# Altium schematic sheet DE-260124.SchDoc: RS485 Radio Bridge
size A3; Author: eldar6776@hotmail.com; DrawnBy: Eldar Dedić; Organization: I-MEDIA GROUP d.o.o.; Address1: Topal Osman Paše 18; Address2: 71000 Sarajevo; Address3: Federacija BiH; Address4: Bosna i Hercegovina; DocumentNumber: 1; Revision: 001; SheetNumber: 1; SheetTotal: 1; ProjectName: RS485 Radio Bridge
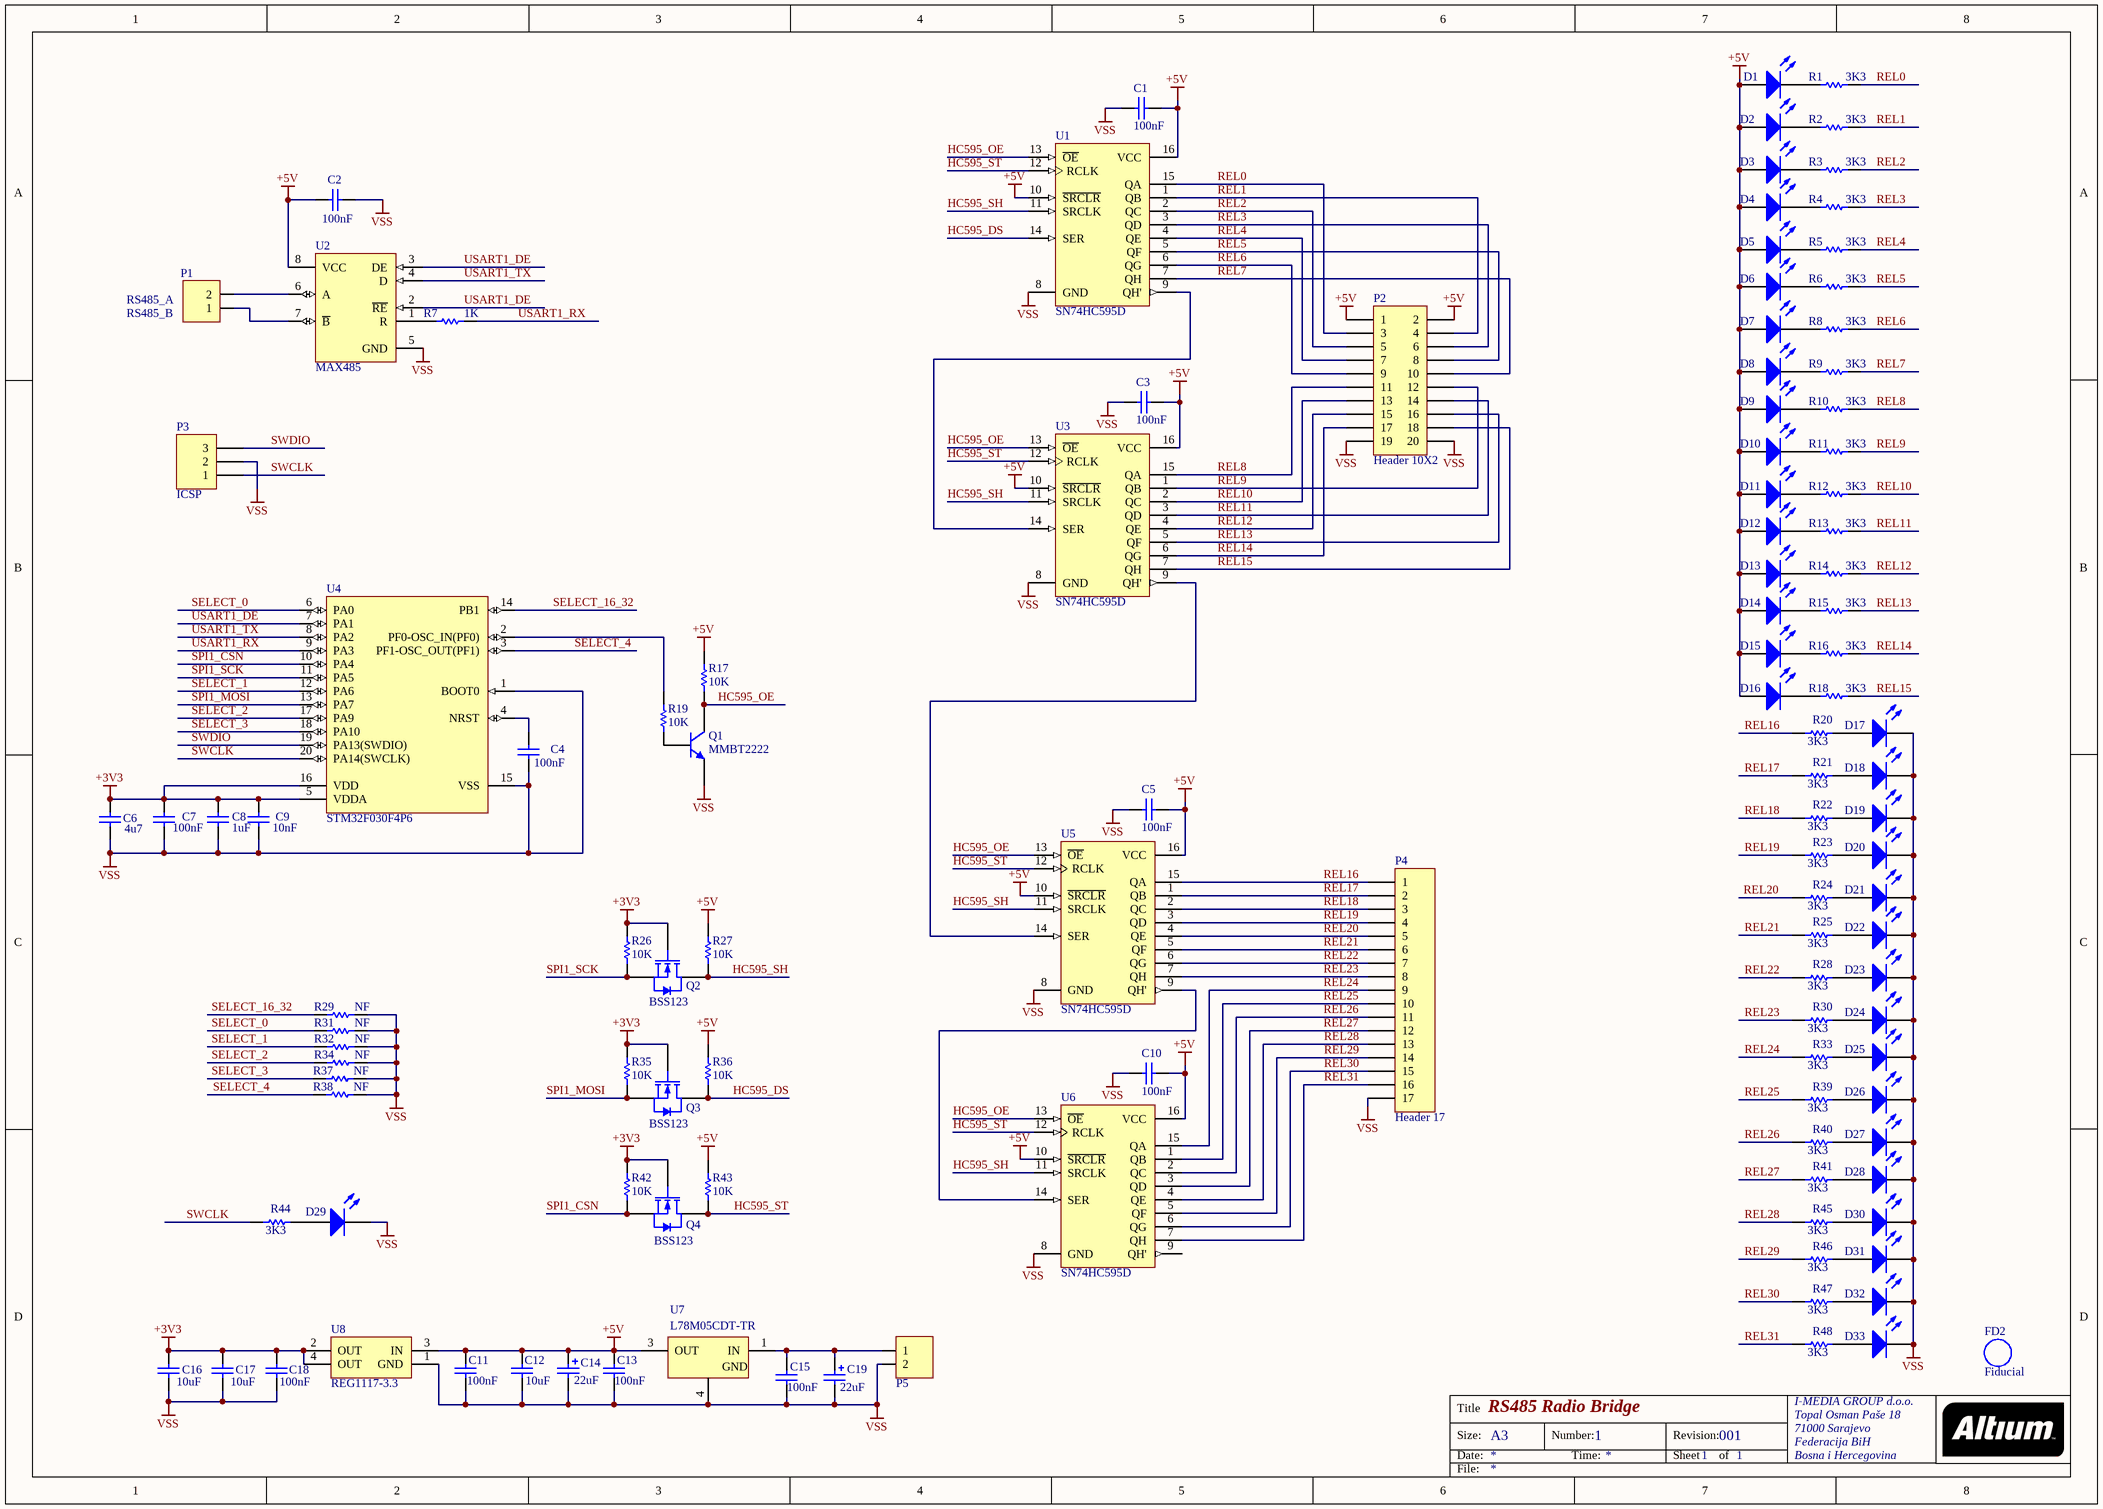
[diagram p0: DE-260124.SchDoc]

## Parts
C1  100nF  [0603]
C2  100nF  [0603]
C3  100nF  [0603]
C4  100nF  [0603]
C5  100nF  [0603]
C6  4u7  [0805]
C7  100nF  [0603]
C8  1uF  [0603]
C9  10nF  [0603]
C10  100nF  [0603]
C11  100nF  [0603]
C12  10uF  [0805]
C13  100nF  [0603]
C14  22uF  [CAPPR2-5X11]
C15  100nF  [0603]
C16  10uF  [0805]
C17  10uF  [0805]
C18  100nF  [0603]
C19  22uF  [CAPPR2-5X11]
D1  LED_RED  [1.6X0.8X0.8]  (value not drawn)
D2  LED_RED  [1.6X0.8X0.8]  (value not drawn)
D3  LED_RED  [1.6X0.8X0.8]  (value not drawn)
D4  LED_RED  [1.6X0.8X0.8]  (value not drawn)
D5  LED_RED  [1.6X0.8X0.8]  (value not drawn)
D6  LED_RED  [1.6X0.8X0.8]  (value not drawn)
D7  LED_RED  [1.6X0.8X0.8]  (value not drawn)
D8  LED_RED  [1.6X0.8X0.8]  (value not drawn)
D9  LED_RED  [1.6X0.8X0.8]  (value not drawn)
D10  LED_RED  [1.6X0.8X0.8]  (value not drawn)
D11  LED_RED  [1.6X0.8X0.8]  (value not drawn)
D12  LED_RED  [1.6X0.8X0.8]  (value not drawn)
D13  LED_RED  [1.6X0.8X0.8]  (value not drawn)
D14  LED_RED  [1.6X0.8X0.8]  (value not drawn)
D15  LED_RED  [1.6X0.8X0.8]  (value not drawn)
D16  LED_RED  [1.6X0.8X0.8]  (value not drawn)
D17  LED_RED  [1.6X0.8X0.8]  (value not drawn)
D18  LED_RED  [1.6X0.8X0.8]  (value not drawn)
D19  LED_RED  [1.6X0.8X0.8]  (value not drawn)
D20  LED_RED  [1.6X0.8X0.8]  (value not drawn)
D21  LED_RED  [1.6X0.8X0.8]  (value not drawn)
D22  LED_RED  [1.6X0.8X0.8]  (value not drawn)
D23  LED_RED  [1.6X0.8X0.8]  (value not drawn)
D24  LED_RED  [1.6X0.8X0.8]  (value not drawn)
D25  LED_RED  [1.6X0.8X0.8]  (value not drawn)
D26  LED_RED  [1.6X0.8X0.8]  (value not drawn)
D27  LED_RED  [1.6X0.8X0.8]  (value not drawn)
D28  LED_RED  [1.6X0.8X0.8]  (value not drawn)
D29  LED_RED  [1.6X0.8X0.8]  (value not drawn)
D30  LED_RED  [1.6X0.8X0.8]  (value not drawn)
D31  LED_RED  [1.6X0.8X0.8]  (value not drawn)
D32  LED_RED  [1.6X0.8X0.8]  (value not drawn)
D33  LED_RED  [1.6X0.8X0.8]  (value not drawn)
FD2  Fiducial  [Fiducial]  (no BOM)
P1  TERMINAL BLOK 2  [TERMINAL BLOK 2]  (value not drawn)
P2  Header 10X2  [HDR2X10]
P3  ICSP  [HDR1X3]
P4  Header 17  [HDR1X17]
P5  TERMINAL BLOK 2  [TERMINAL BLOK 2]  (value not drawn)
Q1  MMBT2222  [SOT23_N]
Q2  BSS123  [SOT23_N]
Q3  BSS123  [SOT23_N]
Q4  BSS123  [SOT23_N]
R1  3K3  [ERA-0603]
R2  3K3  [ERA-0603]
R3  3K3  [ERA-0603]
R4  3K3  [ERA-0603]
R5  3K3  [ERA-0603]
R6  3K3  [ERA-0603]
R7  1K  [ERA-0603]
R8  3K3  [ERA-0603]
R9  3K3  [ERA-0603]
R10  3K3  [ERA-0603]
R11  3K3  [ERA-0603]
R12  3K3  [ERA-0603]
R13  3K3  [ERA-0603]
R14  3K3  [ERA-0603]
R15  3K3  [ERA-0603]
R16  3K3  [ERA-0603]
R17  10K  [ERA-0603]
R18  3K3  [ERA-0603]
R19  10K  [ERA-0603]
R20  3K3  [ERA-0603]
R21  3K3  [ERA-0603]
R22  3K3  [ERA-0603]
R23  3K3  [ERA-0603]
R24  3K3  [ERA-0603]
R25  3K3  [ERA-0603]
R26  10K  [ERA-0603]
R27  10K  [ERA-0603]
R28  3K3  [ERA-0603]
R29  NF  [ERA-0603]
R30  3K3  [ERA-0603]
R31  NF  [ERA-0603]
R32  NF  [ERA-0603]
R33  3K3  [ERA-0603]
R34  NF  [ERA-0603]
R35  10K  [ERA-0603]
R36  10K  [ERA-0603]
R37  NF  [ERA-0603]
R38  NF  [ERA-0603]
R39  3K3  [ERA-0603]
R40  3K3  [ERA-0603]
R41  3K3  [ERA-0603]
R42  10K  [ERA-0603]
R43  10K  [ERA-0603]
R44  3K3  [ERA-0603]
R45  3K3  [ERA-0603]
R46  3K3  [ERA-0603]
R47  3K3  [ERA-0603]
R48  3K3  [ERA-0603]
U1  SN74HC595D  [D016_N]
U2  MAX485  [D008_L]
U3  SN74HC595D  [D016_N]
U4  STM32F030F4P6  [STM-TSSOP20_N]
U5  SN74HC595D  [D016_N]
U6  SN74HC595D  [D016_N]
U7  L78M05CDT-TR  [TO-252_N]
U8  REG1117-3.3  [ZZ311]

## Nets
+3V3: C6.1 C7.1 C8.1 C9.1 C16.2 C17.2 C18.2 Q2.1(G) Q3.1(G) Q4.1(G) R26.1 R35.1 R42.1 U4.5(VDDA) U4.16(VDD) U8.2(OUT) U8.4(OUT)
+5V: C1.1 C2.1 C3.1 C5.1 C10.1 C11.2 C12.2 C13.2 C14.1 D1.1(A) D2.1(A) D3.1(A) D4.1(A) D5.1(A) D6.1(A) D7.1(A) D8.1(A) D9.1(A) D10.1(A) D11.1(A) D12.1(A) D13.1(A) D14.1(A) D15.1(A) D16.1(A) P2.1 P2.2 R17.1 R27.1 R36.1 R43.1 U1.10(~{SRCLR}) U1.16(VCC) U2.8(VCC) U3.10(~{SRCLR}) U3.16(VCC) U5.10(~{SRCLR}) U5.16(VCC) U6.10(~{SRCLR}) U6.16(VCC) U7.3(OUT) U8.3(IN)
VSS: C1.2 C2.2 C3.2 C4.2 C5.2 C6.2 C7.2 C8.2 C9.2 C10.2 C11.1 C12.1 C13.1 C14.2 C15.1 C16.1 C17.1 C18.1 C19.2 D17.2(K) D18.2(K) D19.2(K) D20.2(K) D21.2(K) D22.2(K) D23.2(K) D24.2(K) D25.2(K) D26.2(K) D27.2(K) D28.2(K) D29.2(K) D30.2(K) D31.2(K) D32.2(K) D33.2(K) P2.19 P2.20 P3.2 P4.17 P5.2 Q1.2(E) R29.1 R31.1 R32.1 R34.1 R37.1 R38.1 U1.8(GND) U2.5(GND) U3.8(GND) U4.1(BOOT0) U4.15(VSS) U5.8(GND) U6.8(GND) U7.4(GND) U8.1(GND)
HC595_DS: Q3.3(D) R36.2 U1.14(SER)
HC595_OE: Q1.3(C) R17.2 U1.13(~{OE}) U3.13(~{OE}) U5.13(~{OE}) U6.13(~{OE})
HC595_SH: Q2.3(D) R27.2 U1.11(SRCLK) U3.11(SRCLK) U5.11(SRCLK) U6.11(SRCLK)
HC595_ST: Q4.3(D) R43.2 U1.12(RCLK) U3.12(RCLK) U5.12(RCLK) U6.12(RCLK)
REL0: P2.3 R1.2 U1.15(QA)
REL1: P2.4 R2.2 U1.1(QB)
REL2: P2.5 R3.2 U1.2(QC)
REL3: P2.6 R4.2 U1.3(QD)
REL4: P2.7 R5.2 U1.4(QE)
REL5: P2.8 R6.2 U1.5(QF)
REL6: P2.9 R8.2 U1.6(QG)
REL7: P2.10 R9.2 U1.7(QH)
REL8: P2.11 R10.2 U3.15(QA)
REL9: P2.12 R11.2 U3.1(QB)
REL10: P2.13 R12.2 U3.2(QC)
REL11: P2.14 R13.2 U3.3(QD)
REL12: P2.15 R14.2 U3.4(QE)
REL13: P2.16 R15.2 U3.5(QF)
REL14: P2.17 R16.2 U3.6(QG)
REL15: P2.18 R18.2 U3.7(QH)
REL16: P4.1 R20.1 U5.15(QA)
REL17: P4.2 R21.1 U5.1(QB)
REL18: P4.3 R22.1 U5.2(QC)
REL19: P4.4 R23.1 U5.3(QD)
REL20: P4.5 R24.1 U5.4(QE)
REL21: P4.6 R25.1 U5.5(QF)
REL22: P4.7 R28.1 U5.6(QG)
REL23: P4.8 R30.1 U5.7(QH)
REL24: P4.9 R33.1 U6.15(QA)
REL25: P4.10 R39.1 U6.1(QB)
REL26: P4.11 R40.1 U6.2(QC)
REL27: P4.12 R41.1 U6.3(QD)
REL28: P4.13 R45.1 U6.4(QE)
REL29: P4.14 R46.1 U6.5(QF)
REL30: P4.15 R47.1 U6.6(QG)
REL31: P4.16 R48.1 U6.7(QH)
SELECT_0: R31.2 U4.6(PA0)
SELECT_1: R32.2 U4.12(PA6)
SELECT_2: R34.2 U4.17(PA9)
SELECT_3: R37.2 U4.18(PA10)
SELECT_4: R38.2 U4.3(PF1-OSC_OUT(PF1))
SELECT_16_32: R29.2 U4.14(PB1)
SPI1_CSN: Q4.2(S) R42.2 U4.10(PA4)
SPI1_MOSI: Q3.2(S) R35.2 U4.13(PA7)
SPI1_SCK: Q2.2(S) R26.2 U4.11(PA5)
SWCLK: P3.1 R44.1 U4.20(PA14(SWCLK))
SWDIO: P3.3 U4.19(PA13(SWDIO))
USART1_DE: U2.2(~{RE}) U2.3(DE) U4.7(PA1)
USART1_RX: R7.1 U4.9(PA3)
USART1_TX: U2.4(D) U4.8(PA2)
NetC4_1: C4.1 U4.4(NRST)
NetC15_2: C15.2 C19.1 P5.1 U7.1(IN)
NetD1_2: D1.2(K) R1.1
NetD2_2: D2.2(K) R2.1
NetD3_2: D3.2(K) R3.1
NetD4_2: D4.2(K) R4.1
NetD5_2: D5.2(K) R5.1
NetD6_2: D6.2(K) R6.1
NetD7_2: D7.2(K) R8.1
NetD8_2: D8.2(K) R9.1
NetD9_2: D9.2(K) R10.1
NetD10_2: D10.2(K) R11.1
NetD11_2: D11.2(K) R12.1
NetD12_2: D12.2(K) R13.1
NetD13_2: D13.2(K) R14.1
NetD14_2: D14.2(K) R15.1
NetD15_2: D15.2(K) R16.1
NetD16_2: D16.2(K) R18.1
NetD17_1: D17.1(A) R20.2
NetD18_1: D18.1(A) R21.2
NetD19_1: D19.1(A) R22.2
NetD20_1: D20.1(A) R23.2
NetD21_1: D21.1(A) R24.2
NetD22_1: D22.1(A) R25.2
NetD23_1: D23.1(A) R28.2
NetD24_1: D24.1(A) R30.2
NetD25_1: D25.1(A) R33.2
NetD26_1: D26.1(A) R39.2
NetD27_1: D27.1(A) R40.2
NetD28_1: D28.1(A) R41.2
NetD29_1: D29.1(A) R44.2
NetD30_1: D30.1(A) R45.2
NetD31_1: D31.1(A) R46.2
NetD32_1: D32.1(A) R47.2
NetD33_1: D33.1(A) R48.2
NetP1_1: P1.1 U2.7(~{B})
NetP1_2: P1.2 U2.6(A)
NetQ1_1: Q1.1(B) R19.2
NetR7_2: R7.2 U2.1(R)
NetR19_1: R19.1 U4.2(PF0-OSC_IN(PF0))
NetU1_9: U1.9(QH') U3.14(SER)
NetU3_9: U3.9(QH') U5.14(SER)
NetU5_9: U5.9(QH') U6.14(SER)

Not connected (* = marked no-connect by the designer): U6 9(QH')

## Notes on the sheet
- (near P1) RS485_A
- (near P1) RS485_B
- Title
- Size:
- Date:
- A3
- Number:
- Time:
- Revision:
- Sheet
- of
- File:

## Library data of the parts
C1-C5 C7-C11 C13 C15 C18 = C0603: Ceramic Chip Capacitor - Standard; Note: Footprint corresponds to dimensions for bulk cassette packaging. This case size has tightened tolerances.; Published: 17-Jul-2002; LatestRevisionDate: 19-Mar-2004; LatestRevisionNote: Silkscreen size reduced.; DatasheetDocument: Mar-2001; PackageDocument: Mar-2001; PackageReference: 0603; Publisher: Altium Limited; Code_JEITA: 0603; Code_IPC: 1608 [0603]; ComponentLink1Description: Manufacturer Link; ComponentLink1URL: http://www.kemet.com/; ComponentLink2Description: Datasheet; ComponentLink2URL: http://www.kemet.com/kemet/web/homepage/kechome.nsf/vapubfilesname/F3102TA.pdf/$file/F3102TA.pdf
  C2 C4 C7: Value: 100nF
  C8: Value: 1uF
  C9: Value: 10nF
C6 C12 C16 C17 = C0805: Ceramic Chip Capacitor - Standard; Note: Footprint corresponds to dimensions for bulk cassette packaging. This case size has tightened tolerances.; Published: 17-Jul-2002; LatestRevisionDate: 19-Mar-2004; LatestRevisionNote: Silkscreen size reduced.; DatasheetDocument: Mar-2001; PackageDocument: Mar-2001; PackageReference: 0805; Publisher: Altium Limited; Code_JEITA: 0805; Code_IPC: 2012[0805]; ComponentLink1Description: Manufacturer Link; ComponentLink1URL: http://www.kemet.com/; ComponentLink2Description: Datasheet; ComponentLink2URL: http://www.kemet.com/kemet/web/homepage/kechome.nsf/vapubfilesname/F3102TA.pdf/$file/F3102TA.pdf
  C6: Value: 4u7
C14 C19 = EKA00AA247F00: Aluminum Electrolytic Capacitor, Radial Style with Long Leads: 47uF, 35V; Note: Refer to Manufacturer's Data Sheets for other lead formations; DrillSize: Nominal, Rounded To The Nearest 0.1mm; Published: 19-Mar-2004; DatasheetDocument: 20-Feb-2001; PackageReference: CAPPR2-5X11; Publisher: Altium Limited; ComponentLink1Description: Manufacturer Link; ComponentLink1URL: http://www.vishay.com/; ComponentLink2Description: Datasheet; ComponentLink2URL: http://www.vishay.com/docs/25014/eka.pdf; Value: 47uF
D1-D33 = HSMZ-C190: High Performance Chip LED, Red; LuminousIntensity: 40mcd (Minimum).; PCB_Layout: Complies with manufacturer's recommendation.; Published: 11-Dec-2002; DatasheetDocument: 11-Mar-2002; PackageDocument: 11-Mar-2002; PackageReference: 1.6X0.8X0.8; Publisher: Altium Limited; LED_Colour: Red; ComponentLink1Description: Manufacturer Link; ComponentLink1URL: http://www.agilent.com/; ComponentLink2Description: Datasheet; ComponentLink2URL: http://cp.literature.agilent.com/litweb/pdf/5988-5891EN.pdf
FD2 = Fiduchial: Fiduchial mark
P1 P5 = TERMINAL BLOK 2: 2 pinski terminal blok
P2 = Header 10X2: Header, 10-Pin, Dual row; LatestRevisionDate: 17-Jul-2002; LatestRevisionNote: Re-released for DXP Platform.; Publisher: Altium Limited
P3 = Header 3: Header, 3-Pin; LatestRevisionDate: 17-Jul-2002; LatestRevisionNote: Re-released for DXP Platform.; Publisher: Altium Limited
P4 = Header 17: Header, 17-Pin; LatestRevisionDate: 17-Jul-2002; LatestRevisionNote: Re-released for DXP Platform.; Publisher: Altium Limited
Q1 = BC817: NPN General-purpose Transistor; Published: 17-Sep-2003; LatestRevisionDate: 12-Dec-2006; LatestRevisionNote: IPC-7351 Footprint Added.; DatasheetVersion: Jun-1999; PackageVersion: May-1999; PackageReference: SOT23; Publisher: Altium Limited; PackageDescription: 3-Pin SOT-23 Package 0.95 mm Pitch, 2.3 mm Lead Span; ComponentLink1Description: Manufacturer Link; ComponentLink1URL: http://www.semiconductors.philips.com/; ComponentLink2Description: Datasheet; ComponentLink2URL: http://www.semiconductors.philips.com/acrobat/datasheets/BC817_BC817W_BC337_5.pdf
Q2-Q4 = BSS123: N-channel Enhancement Mode Vertical D-MOSFET; Published: 17-Sep-2003; LatestRevisionDate: 12-Dec-2006; LatestRevisionNote: IPC-7351 Footprint Added.; DatasheetVersion: Apr-1995; PackageVersion: May-1999; PackageReference: SOT23; Publisher: Altium Limited; PackageDescription: 3-Pin SOT-23 Package 0.95 mm Pitch, 2.3 mm Lead Span; ComponentLink1Description: Manufacturer Link; ComponentLink1URL: http://www.semiconductors.philips.com/; ComponentLink2Description: Datasheet; ComponentLink2URL: http://www.semiconductors.philips.com/acrobat/datasheets/BSS123_3.pdf
R1-R6 R8-R16 R18 R20-R25 R28 R30 R33 R39-R41 R44-R48 = ERA3Y: Rectangular Thick Film Chip Resistor, 10 Ohm to 330k Ohm Range, 0.1% and 0.5% Tolerance, 0603 Size, 0.063 W; Note: If flow soldering, adjust pad width of PCB Footprint to 0.7 - 0.8 times the width of the resistor.; Published: 17-Dec-2003; LatestRevisionDate: 19-Mar-2004; LatestRevisionNote: Silkscreen size reduced.; PackageDocument: Mar-2003; PackageReference: ERA-0603; Publisher: Altium Limited; Code_IPC: 1608 [0603]; ComponentLink1Description: Manufacturer Link; ComponentLink1URL: http://www.panasonic.com/industrial/components/resistive_products.htm; ComponentLink2Description: Datasheet; ComponentLink2URL: http://www.panasonic.com/industrial/components/pdf/AOA0000CE8.pdf
R7 R17 R19 R26 R27 R29 R31 R32 R34-R38 R42 R43 = ERA6Y: Rectangular Thick Film Chip Resistor, 10 Ohm to 1M Ohm Range, 0.1% and 0.5% Tolerance, 0805 Size, 0.1 W; Note: If flow soldering, adjust pad width of PCB Footprint to 0.7 - 0.8 times the width of the resistor.; Published: 17-Dec-2003; LatestRevisionDate: 19-Mar-2004; LatestRevisionNote: Silkscreen size reduced.; PackageDocument: Mar-2003; PackageReference: ERA-0805; Publisher: Altium Limited; Code_IPC: 2012 [0805]; ComponentLink1Description: Manufacturer Link; ComponentLink1URL: http://www.panasonic.com/industrial/components/resistive_products.htm; ComponentLink2Description: Datasheet; ComponentLink2URL: http://www.panasonic.com/industrial/components/pdf/AOA0000CE8.pdf
U1 U3 U5 U6 = SN74HC595D: 8-Bit Shift Register with 3-State Output Registers; Published: 8-Jun-2000; LatestRevisionDate: 13-Apr-2006; LatestRevisionNote: IPC-7351 Footprint Added.; DatasheetVersion: May-1997; PackageVersion: Jan-1998; PackageReference: D016; Publisher: Altium Limited; PackageDescription: 16-Pin Small Outline Integrated Circuit 1.27 mm Pitch; Code_IPC: SOIC127P600-16; ComponentLink1Description: Manufacturer Link; ComponentLink1URL: http://www.ti.com/; ComponentLink2Description: Datasheet; ComponentLink2URL: http://www-s.ti.com/sc/ds/sn74hc595.pdf
U2 = SN75176BD: Differential Bus Transceiver; Note: Receiver Hysteresis of 50mV Typical; Published: 15-May-2002; LatestRevisionDate: 13-Apr-2006; LatestRevisionNote: IPC-7351 Footprint Added.; DatasheetVersion: Sep-1989; PackageVersion: Jan-1998; PackageReference: D008; Publisher: Altium Limited; PackageDescription: 8-Pin Small Outline Integrated Circuit 1.27 mm Pitch; Code_IPC: SOIC127P600-8; ComponentLink1Description: Manufacturer Link; ComponentLink1URL: http://www.ti.com/; ComponentLink2Description: Datasheet; ComponentLink2URL: http://www-s.ti.com/sc/ds/sn75176b.pdf
U4 = STM32F030F4P6: ARM Cortex-M0 32-bit MCU, 16 KB Flash, 4 KB Internal RAM, 15 I/Os, 20-pin TSSOP, -40 to 85 degC, Tube; FLASH Size (Prog) (kB): 16; I/Os (High Current): 15; Internal RAM Size (kB): 4; Operating Frequency(F) (Processor speed) (MHz): 48; Supply Voltage(Vcc) min (V): 2.4; DatasheetVersion: Rev. 1; PackageVersion: Rev. 1, 11/2012; PackageReference: TSSOP20; PackageDescription: 20-Pin Thin Shrink Small Outline Package, 6.5 x 4.4 mm Body, 0.65 mm Pitch; Supplier 1: Digi-Key; Supplier Part Number 1: 497-14044-5-ND; Supplier 2: Newark; Supplier Part Number 2: 06X3648; Supplier 3: Mouser; Supplier Part Number 3: 511-STM32F030F4P6; Core: ARM Cortex-M0; Packing: Tube; Mounting Technology: Surface Mount; PartNumber: STM32F030F4P6; ComponentLink1Description: Manufacturer URL; ComponentLink1URL: http://www.st.com/web/en/home.html; ComponentLink2Description: Datasheet; ComponentLink2URL: http://www.st.com/st-web-ui/static/active/en/resource/technical/document/datasheet/DM00088500.pdf; ComponentLink3Description: Package Specification; ComponentLink3URL: http://www.st.com/st-web-ui/static/active/en/resource/technical/document/datasheet/DM00065136.pdf
U7 = L78M05CDT-TR: Positive Voltage Regulator, 5V, 3-Pin DPAK, Tape and Reel; DatasheetVersion: Nov-2010; PackageVersion: 2011; PackageReference: TO-252; PackageDescription: 3-Pin Transistor Outline Package 2.28 mm Pitch, 9.7 mm Lead Span (DPAK); PartNumber: L78M05CDT-TR; ComponentLink1Description: Manufacturer URL; ComponentLink1URL: http://www.st.com; ComponentLink2Description: Datasheet; ComponentLink2URL: http://www.st.com/internet/com/TECHNICAL_RESOURCES/TECHNICAL_LITERATURE/DATASHEET/CD00000447.pdf
U8 = REG1117-3.3: 800mA and 1A Low Dropout Positive Regulator 2.85V, 3.3V, 5V, and Adjustable; Published: 8-Jun-2000; LatestRevisionDate: 17-Jul-2002; LatestRevisionNote: Re-released for DXP Platform.; DatasheetVersion: Sep-1997; PackageVersion: revC; PackageReference: ZZ311; Publisher: Altium Limited; PackageDescription: SOT-223/SC-73; 4 Leads; Body 6.7 x 7.3 mm, inc. leads (LxW max); ComponentLink1Description: Manufacturer Link; ComponentLink1URL: http://www.ti.com/; ComponentLink2Description: Datasheet; ComponentLink2URL: http://www-s.ti.com/sc/ds/REG1117.pdf